# EAGLE schematic AnalogInputModule2_r1_0 (EAGLE 9.6.2)
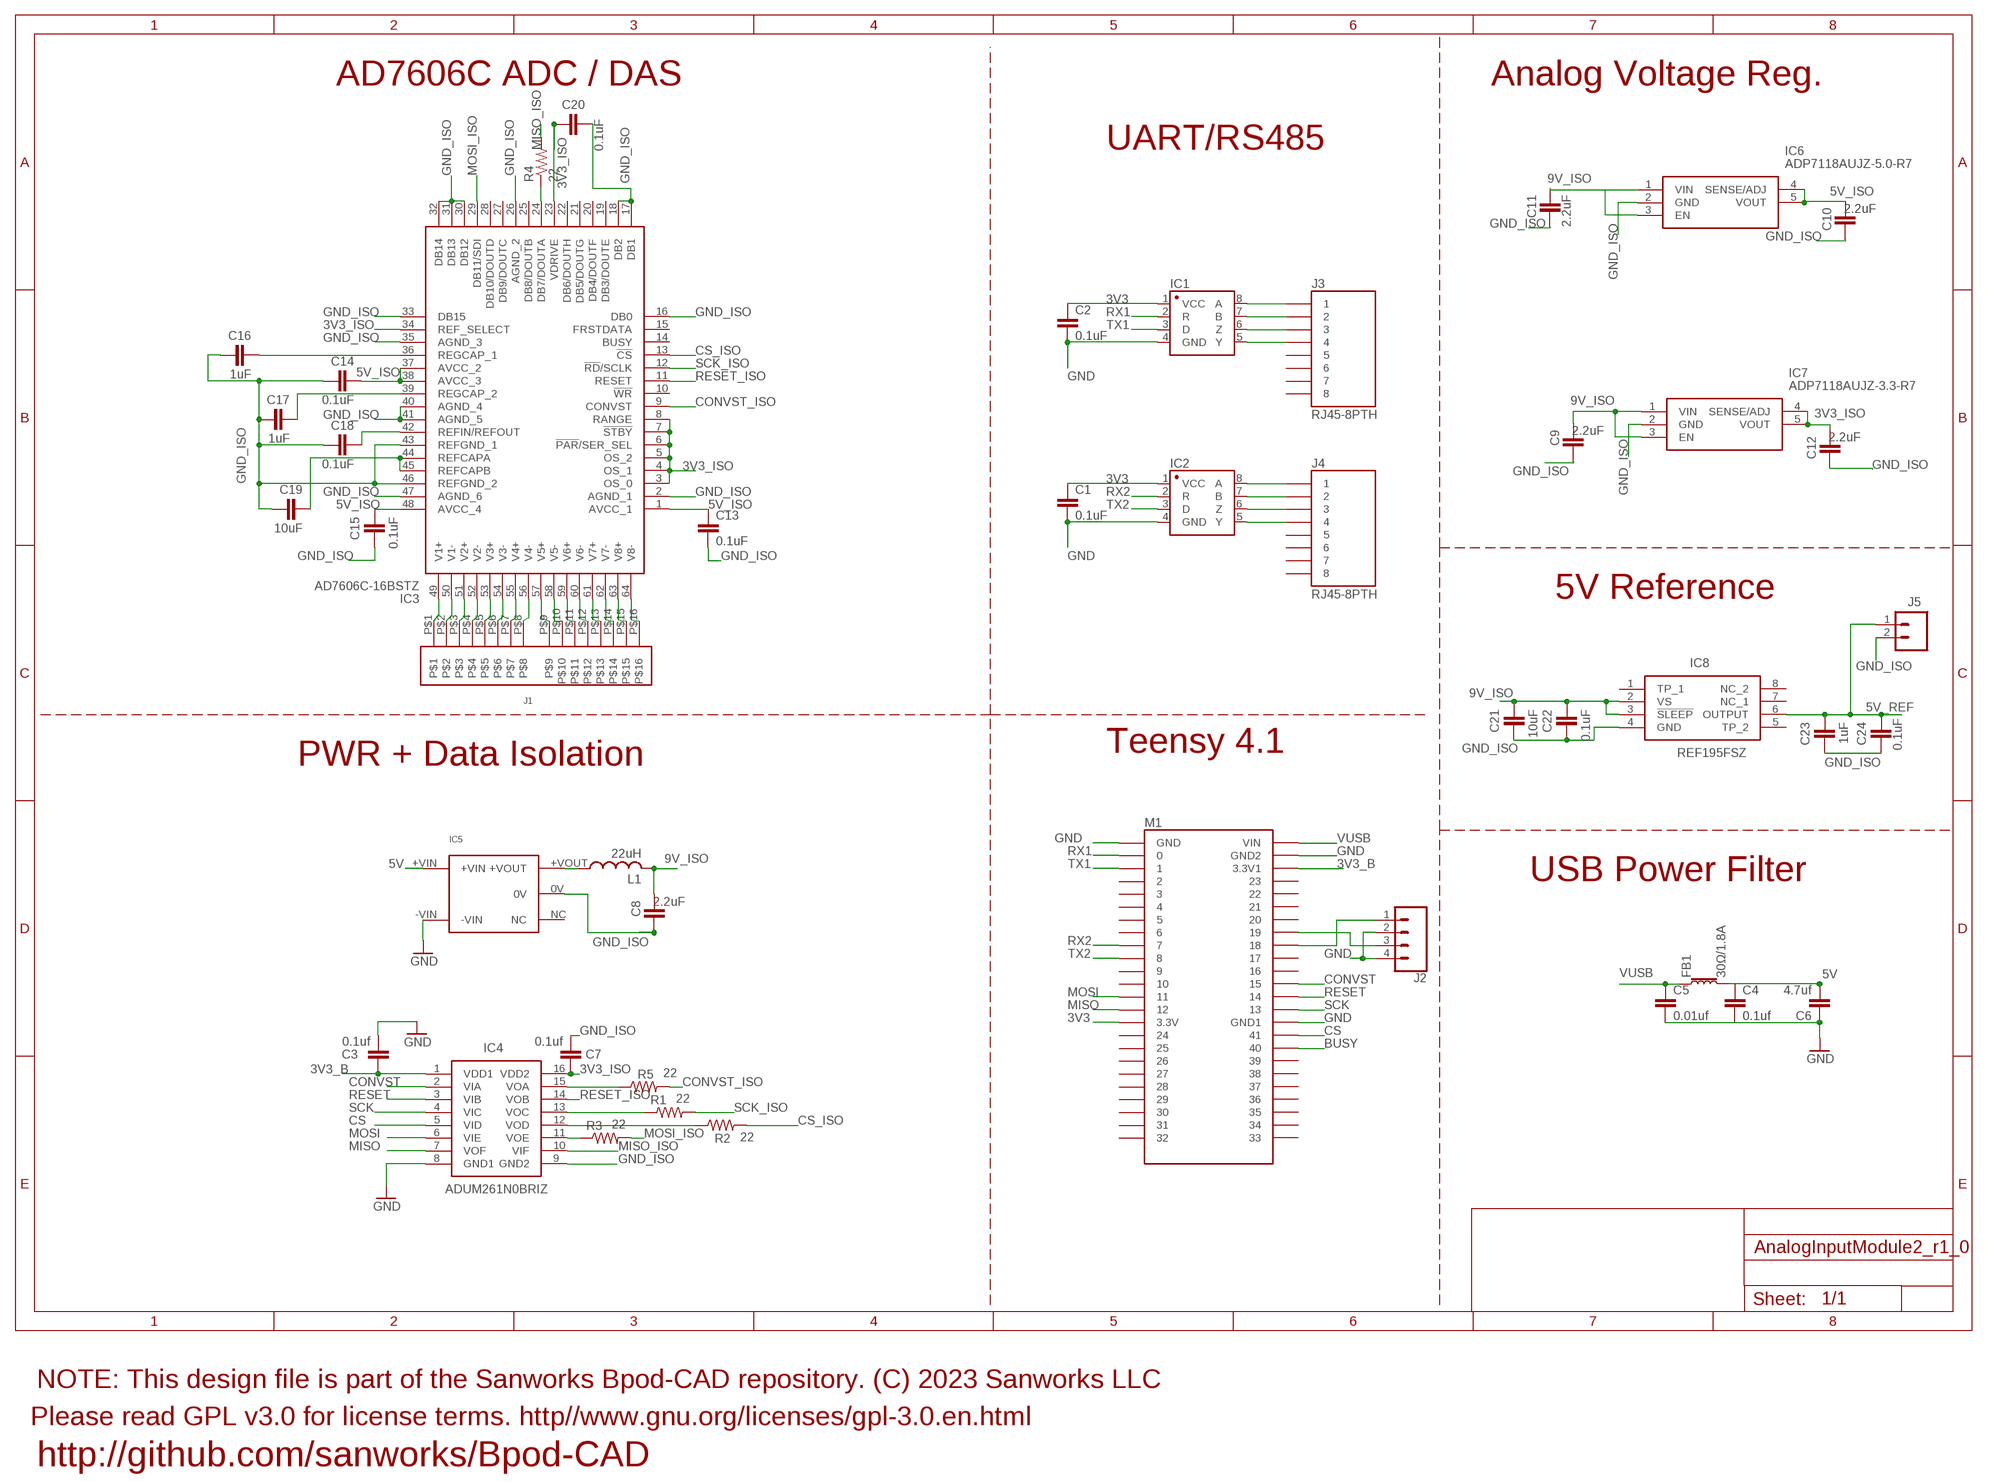
[diagram p0: schematic, sheet 1]

## Parts
C1  0.1uF  1.0UF-0805-25V-10%  [0805]
C2  0.1uF  1.0UF-0805-25V-10%  [0805]
C3  0.1uf  1.0UF-0805-25V-10%  [0805]
C4  0.1uf  10UF-0805-10V-10%  [0805]
C5  0.01uf  10UF-0805-10V-10%  [0805]
C6  4.7uf  CAP1206  [1206@2]
C7  0.1uf  1.0UF-0805-25V-10%  [0805]
C8  2.2uF  1.0UF-0805-25V-(+80/-20%)  [0805]
C9  2.2uF  1.0UF-0805-25V-(+80/-20%)  [0805]
C10  2.2uF  1.0UF-0805-25V-(+80/-20%)  [0805]
C11  2.2uF  1.0UF-0805-25V-(+80/-20%)  [0805]
C12  2.2uF  1.0UF-0805-25V-(+80/-20%)  [0805]
C13  0.1uF  1.0UF-0805-25V-10%  [0805]
C14  0.1uF  1.0UF-0805-25V-10%  [0805]
C15  0.1uF  1.0UF-0805-25V-10%  [0805]
C16  1uF  1.0UF-0805-25V-10%  [0805]
C17  1uF  1.0UF-0805-25V-10%  [0805]
C18  0.1uF  1.0UF-0805-25V-10%  [0805]
C19  10uF  1.0UF-0805-25V-10%  [0805]
C20  0.1uF  1.0UF-0805-25V-10%  [0805]
C21  10uF  1.0UF-0805-25V-10%  [0805]
C22  0.1uF  1.0UF-0805-25V-10%  [0805]
C23  1uF  1.0UF-0805-25V-10%  [0805]
C24  0.1uF  1.0UF-0805-25V-10%  [0805]
FB1  30Ω/1.8A  FERRITE_BEAD-0603  [0603]
IC1  SN65HVD31DR  [SO08]
IC2  SN65HVD31DR  [SO08]
IC3  AD7606C-16BSTZ  [QFP50P1200X1200X160-64N]
IC4  ADUM261N0BRIZ  [SOIC127P1030X264-16N]
IC5  5V  MTU1D0505MC  [MTU1D0505MC]
IC6  ADP7118AUJZ-5.0-R7  [SOT95P280X100-5N]
IC7  ADP7118AUJZ-3.3-R7  [SOT95P280X100-5N]
IC8  REF195FSZ  [SOIC127P600X175-8N]
J1  16POS_MOLEX_SOCKET  [16POS_MOLEX_SOCKET]
J2  CONN_04SCREW_LOCK  [SCREWTERMINAL-3.5MM-4_LOCK]
J3  RJ45-8PTH  [RJ45-8]
J4  RJ45-8PTH  [RJ45-8]
J5  CONN_023.5MM_LOCK  [SCREWTERMINAL-3.5MM-2_LOCK]
L1  22uH  L-USL3225M  [L3225M]
M1  TEENSY4.1_SIDESONLY  [TEENSY4.1_SIDESONLY]
R1  22  R-US_R0805  [R0805]
R2  22  R-US_R0805  [R0805]
R3  22  R-US_R0805  [R0805]
R4  22  R-US_R0805  [R0805]
R5  22  R-US_R0805  [R0805]

## Nets
3V3: C1.1 C2.1 IC1.1(VCC) IC2.1(VCC) M1.3V3(3.3V)
3V3_B: C3.1 IC4.1(VDD1) M1.3V3_LO(3.3V1)
3V3_ISO: C7.1 C12.2 C20.1 IC3.3(OS_0) IC3.4(OS_1) IC3.5(OS_2) IC3.6(!PAR!/SER_SEL) IC3.7(!STBY) IC3.8(RANGE) IC3.23(VDRIVE) IC3.34(REF_SELECT) IC4.16(VDD2) IC7.4(SENSE/ADJ) IC7.5(VOUT)
5V: C4.1 C6.2 FB1.2 IC5.+VIN
5V_ISO: C10.2 C13.1 C14.2 C15.2 IC3.1(AVCC_1) IC3.37(AVCC_2) IC3.38(AVCC_3) IC3.48(AVCC_4) IC6.4(SENSE/ADJ) IC6.5(VOUT)
5V_REF: C23.2 C24.2 IC8.6(OUTPUT) J5.1
9V_ISO: C8.2 C9.2 C11.2 C21.2 C22.2 IC6.1(VIN) IC6.3(EN) IC7.1(VIN) IC7.3(EN) IC8.2(VS) IC8.3(!SLEEP) L1.2
BUSY: M1.40
CONVST: IC4.2(VIA) M1.15/A1
CONVST_ISO: IC3.9(CONVST) R5.2
CS: IC4.5(VID) M1.41
CS_ISO: IC3.13(!CS) R2.2
GND: C1.2 C2.2 C3.2 C4.2 C5.2 C6.1 IC1.4(GND) IC2.4(GND) IC4.8(GND1) IC5.-VIN J2.2 J2.4 M1.AGND(GND) M1.GND1(GND2) M1.GND(GND1)
GND_ISO: C7.2 C8.1 C9.1 C10.1 C11.1 C12.1 C13.2 C14.1 C15.1 C16.1 C17.1 C18.1 C19.1 C20.2 C21.1 C22.1 C23.1 C24.1 IC3.2(AGND_1) IC3.16(DB0) IC3.17(DB1) IC3.18(DB2) IC3.26(AGND_2) IC3.30(DB12) IC3.31(DB13) IC3.32(DB14) IC3.33(DB15) IC3.35(AGND_3) IC3.40(AGND_4) IC3.41(AGND_5) IC3.43(REFGND_1) IC3.46(REFGND_2) IC3.47(AGND_6) IC4.9(GND2) IC5.0V IC6.2(GND) IC7.2(GND) IC8.4(GND) J5.2
MISO: IC4.7(VOF) M1.12/MISO
MISO_ISO: IC4.10(VIF) R4.2
MOSI: IC4.6(VIE) M1.11/MOSI
MOSI_ISO: IC3.29(DB11/SDI) R3.2
N$1: IC1.6(Z) J3.3
N$3: IC1.8(A) J3.1
N$4: IC1.5(Y) J3.4
N$5: IC1.7(B) J3.2
N$6: IC2.6(Z) J4.3
N$7: IC2.5(Y) J4.4
N$8: IC2.8(A) J4.1
N$9: IC2.7(B) J4.2
N$10: IC3.64(V8-) J1.P$16
N$11: IC3.63(V8+) J1.P$15
N$12: IC3.62(V7-) J1.P$14
N$13: IC3.61(V7+) J1.P$13
N$14: IC3.60(V6-) J1.P$12
N$15: IC3.59(V6+) J1.P$11
N$16: IC3.58(V5-) J1.P$10
N$17: IC3.57(V5+) J1.P$9
N$18: IC3.56(V4-) J1.P$8
N$19: IC3.55(V4+) J1.P$7
N$20: IC3.54(V3-) J1.P$6
N$21: IC3.53(V3+) J1.P$5
N$22: IC3.52(V2-) J1.P$4
N$23: IC3.51(V2+) J1.P$3
N$24: IC3.50(V1-) J1.P$2
N$25: IC3.49(V1+) J1.P$1
N$27: IC4.13(VOC) R1.1
N$28: IC4.12(VOD) R2.1
N$29: IC4.11(VOE) R3.1
N$30: IC3.24(DB7/DOUTA) R4.1
N$31: IC4.15(VOA) R5.1
N$32: C16.2 IC3.36(REGCAP_1)
N$33: C17.2 IC3.39(REGCAP_2)
N$34: C18.2 IC3.42(REFIN/REFOUT)
N$35: C19.2 IC3.44(REFCAPA) IC3.45(REFCAPB)
N$36: J2.1 M1.18/A4/SDA
N$37: IC5.+VOUT L1.1
N$38: J2.3 M1.19/A5/SCL
RESET: IC4.3(VIB) M1.14/A0
RESET_ISO: IC3.11(RESET) IC4.14(VOB)
RX1: IC1.2(R) M1.0/RX
RX2: IC2.2(R) M1.7
SCK: IC4.4(VIC) M1.13/SCK
SCK_ISO: IC3.12(!RD!/SCLK) R1.2
TX1: IC1.3(D) M1.1/TX
TX2: IC2.3(D) M1.8
VUSB: C5.1 FB1.1 M1.VIN
Unconnected: IC3.10(!WR) IC3.14(BUSY) IC3.15(FRSTDATA) IC3.19(DB3/DOUTE) IC3.20(DB4/DOUTF) IC3.21(DB5/DOUTG) IC3.22(DB6/DOUTH) IC3.25(DB8/DOUTB) IC3.27(DB9/DOUTC) IC3.28(DB10/DOUTD) IC5.NC IC8.1(TP_1) IC8.5(TP_2) IC8.7(NC_1) IC8.8(NC_2) J3.5 J3.6 J3.7 J3.8 J4.5 J4.6 J4.7 J4.8 M1.2 M1.3 M1.4 M1.5 M1.6 M1.9 M1.10/CS M1.16/A2 M1.17/A3 M1.20/A6 M1.21/A7 M1.22/A8 M1.23/A9 M1.24 M1.25 M1.26 M1.27 M1.28 M1.29 M1.30 M1.31/A12 M1.32 M1.33 M1.34 M1.35 M1.36 M1.37 M1.38 M1.39

## Notes on the sheet
- AD7606C ADC / DAS | Analog Voltage Reg.
- UART/RS485
- 5V Reference
- Teensy 4.1
- PWR + Data Isolation
- USB Power Filter
- NOTE: This design file is part of the Sanworks Bpod-CAD repository. (C) 2023 Sanworks LLC
- Please read GPL v3.0 for license terms. http//www.gnu.org/licenses/gpl-3.0.en.html
- http://github.com/sanworks/Bpod-CAD

## Library data of the parts
C1-C3 C7 C13-C24 = SparkFun-Capacitors:1.0UF: 1µF ceramic capacitors A capacitor is a passive two-terminal electrical component used to store electrical energy temporarily in an electric field.; PROD_ID: CAP-08064; VALUE: 1.0uF
C4 C5 = SparkFun-Capacitors:10UF: 10.0µF ceramic capacitors A capacitor is a passive two-terminal electrical component used to store electrical energy temporarily in an electric field.; PROD_ID: CAP-11330; VALUE: 10uF
C6 = SparkFun-Capacitors:CAP: Capacitor Standard 0603 ceramic capacitor, and 0.1" leaded capacitor.
C8-C12 = SparkFun-Capacitors:1.0UF: 1µF ceramic capacitors A capacitor is a passive two-terminal electrical component used to store electrical energy temporarily in an electric field.; PROD_ID: CAP-11625; VALUE: 1.0uF
FB1 = SparkFun-Coils:FERRITE_BEAD: Ferrite Bead (blocks, cores, rings, chokes, etc.) Inductor with layers of ferrite used to suppress high frequencies. Often used to isolate high frequency noise. SparkFun Products: IOIO-OTG - V2.2 <https://www.sparkfun.com/products/13613> SparkFun SAMD21 Mini Breakout <https://www.sparkfun.com/products/13664> SparkFun 6 Degrees of Freedom Breakout - LSM6DS3 <https://www.sparkfun.com/products/13339> SparkFun SAMD21 Dev Breakout <https://www.sparkfun.com/products/13672>; PROD_ID: NDUC-13805
IC1 IC2 = Joshparts4:SN65HVD31DR: A placeholder for generic narrow & wide SOIC8 foorptints - used on the DIP adapter board.
IC3 = AD7606C-16BSTZ:AD7606C-16BSTZ: 8-Channel Octal ADC SAR 1Msps 16-bit Parallel/Serial (3-Wire, SPI) 64-Pin LQFP T/R Source: Datasheet <https://www.arrow.com/en/products/ad7606c-16bstz/analog-devices>; DESCRIPTION: 8-Channel Octal ADC SAR 1Msps 16-bit Parallel/Serial (3-Wire, SPI) 64-Pin LQFP T/R; HEIGHT: 1.6mm; MANUFACTURER_NAME: Analog Devices; MANUFACTURER_PART_NUMBER: AD7606C-16BSTZ; MOUSER_PART_NUMBER: 584-AD7606C-16BSTZ; MOUSER_PRICE-STOCK: https://www.mouser.co.uk/ProductDetail/Analog-Devices/AD7606C-16BSTZ?qs=pUKx8fyJudAIi5elYfPn7w%3D%3D
IC4 = ADUM261N0BRIZ:ADUM261N0BRIZ: Digital Isolators Robust 5kV 6 CH digital ISO, 5/1 Source: Datasheet <https://www.analog.com/media/en/technical-documentation/data-sheets/ADuM260N-261N-262N-263N.pdf>; DESCRIPTION: Digital Isolators Robust 5kV 6 CH digital ISO, 5/1; HEIGHT: 2.64mm; MANUFACTURER_NAME: Analog Devices; MANUFACTURER_PART_NUMBER: ADUM261N0BRIZ; MOUSER_PART_NUMBER: 584-ADUM261N0BRIZ; MOUSER_PRICE-STOCK: https://www.mouser.co.uk/ProductDetail/Analog-Devices/ADUM261N0BRIZ?qs=OpCP5WdiozfBAczC%252BdQwOQ%3D%3D
IC5 = JoshParts10:MTU1D0505MC
IC6 = ADP7118AUJZ-5.0-R7:ADP7118AUJZ-5.0-R7: LDO Voltage Regulators 20V 200mA LDO 5.0Vo Source: Datasheet <https://www.analog.com/media/en/technical-documentation/data-sheets/adp7118.pdf>; DESCRIPTION: LDO Voltage Regulators 20V 200mA LDO 5.0Vo; HEIGHT: 1mm; MANUFACTURER_NAME: Analog Devices; MANUFACTURER_PART_NUMBER: ADP7118AUJZ-5.0-R7; MOUSER_PART_NUMBER: 584-ADP7118AUJZ5.0R7; MOUSER_PRICE-STOCK: https://www.mouser.co.uk/ProductDetail/Analog-Devices/ADP7118AUJZ-5.0-R7?qs=hpwIUhX6lWzp%252BHPslBdPxA%3D%3D
IC7 = ADP7118AUJZ-3.3-R7:ADP7118AUJZ-3.3-R7: LDO Regulator Pos 3.3V 0.2A 5-Pin TSOT-23 T/R Source: Datasheet <http://www.analog.com/media/en/technical-documentation/data-sheets/ADP7118.pdf>; DESCRIPTION: LDO Regulator Pos 3.3V 0.2A 5-Pin TSOT-23 T/R; HEIGHT: 1mm; MANUFACTURER_NAME: Analog Devices; MANUFACTURER_PART_NUMBER: ADP7118AUJZ-3.3-R7; MOUSER_PART_NUMBER: 584-ADP7118AUJZ3.3R7; MOUSER_PRICE-STOCK: https://www.mouser.co.uk/ProductDetail/Analog-Devices/ADP7118AUJZ-3.3-R7?qs=hpwIUhX6lWxSxNRE9lKdtQ%3D%3D
IC8 = REF195FSZ:REF195FSZ: REF195FSZ, Precision Voltage Reference 4.995 to 5.005V, 2mV 30mA 18V max. 8-Pin SOIC Source: Datasheet <https://datasheet.datasheetarchive.com/originals/distributors/SFDatasheet-4/sf-00085609.pdf>; DESCRIPTION: REF195FSZ, Precision Voltage Reference 4.995 to 5.005V, 2mV 30mA 18V max. 8-Pin SOIC; HEIGHT: 1.75mm; MANUFACTURER_NAME: Analog Devices; MANUFACTURER_PART_NUMBER: REF195FSZ; MOUSER_PART_NUMBER: 584-REF195FSZ; MOUSER_PRICE-STOCK: https://www.mouser.co.uk/ProductDetail/Analog-Devices/REF195FSZ?qs=WIvQP4zGanhjJxXxvDF9Xg%3D%3D
J1 = JoshParts10:16POS_MOLEX_SOCKET
J2 = SparkFun-Connectors:CONN_04: Multi connection point. Often used as Generic Header-pin footprint for 0.1 inch spaced/style header connections On any of the 0.1 inch spaced packages, you can populate with these: Break Away Headers - Straight <https://www.sparkfun.com/products/116> (PRT-00116) Break Away Male Headers - Right Angle <https://www.sparkfun.com/products/553> (PRT-00553) Female Headers <https://www.sparkfun.com/products/115> (PRT-00115) Break Away Headers - Machine Pin <https://www.sparkfun.com/products/117> (PRT-00117) Break Away Female Headers - Swiss Machine Pin <https://www.sparkfun.com/products/743> (PRT-00743) For SCREWTERMINALS and SPRING TERMINALS visit here: Screw Terimnals on SparkFun.com <https://www.sparkfun.com/search/results?term=Screw+Terminals> (5mm/3.5mm/2.54mm spacing) This device is also useful as a general connection point to wire up your design to another part of your project. Our various solder wires solder well into these plated through hole pads. Hook-Up Wire - Assortment (Stranded, 22 AWG) <https://www.sparkfun.com/products/11375> (PRT-11375) Hook-Up Wire - Assortment (Solid Core, 22 AWG) <https://www.sparkfun.com/products/11367> (PRT-11367) View the entire wire category on our website here <https://www.sparkfun.com/categories/141> Special notes: Molex polarized connector foot print use with SKU : PRT-08231 with associated crimp pins and housings. 1MM SMD Version SKU: PRT-10208
J3 J4 = SparkFun:RJ45-8: RJ45 Jack Simple RJ45, 8-pin connection - connector for common Cat5, Cat5e, and Cat6 Ethernet cables. Footprint not yet proven in production. Connector sku is PRT-00643; Breakout PCB sku is BOB-00716.
J5 = SparkFun-Connectors:CONN_02: Multi connection point. Often used as Generic Header-pin footprint for 0.1 inch spaced/style header connections On any of the 0.1 inch spaced packages, you can populate with these: Break Away Headers - Straight <https://www.sparkfun.com/products/116> (PRT-00116) Break Away Male Headers - Right Angle <https://www.sparkfun.com/products/553> (PRT-00553) Female Headers <https://www.sparkfun.com/products/115> (PRT-00115) Break Away Headers - Machine Pin <https://www.sparkfun.com/products/117> (PRT-00117) Break Away Female Headers - Swiss Machine Pin <https://www.sparkfun.com/products/743> (PRT-00743) For SCREWTERMINALS and SPRING TERMINALS visit here: Screw Terimnals on SparkFun.com <https://www.sparkfun.com/search/results?term=Screw+Terminals> (5mm/3.5mm/2.54mm spacing) This device is also useful as a general connection point to wire up your design to another part of your project. Our various solder wires solder well into these plated through hole pads. Hook-Up Wire - Assortment (Stranded, 22 AWG) <https://www.sparkfun.com/products/11375> (PRT-11375) Hook-Up Wire - Assortment (Solid Core, 22 AWG) <https://www.sparkfun.com/products/11367> (PRT-11367) View the entire wire category on our website here <https://www.sparkfun.com/categories/141> Special notes: Molex polarized connector foot print use with: PRT-08233 with associated crimp pins and housings. 2.54_SCREWTERM for use with PRT-10571. 3.5mm Screw Terminal footprints for PRT-08084 5mm Screw Terminal footprints for use with PRT-08432; PROD_ID: CONN-08399
L1 = rcl:L-US: INDUCTOR, American symbol
M1 = teensy4.1.dist:TEENSY4.1_SIDESONLY
R1-R5 = adafruit:R-US_: RESISTOR, American symbol